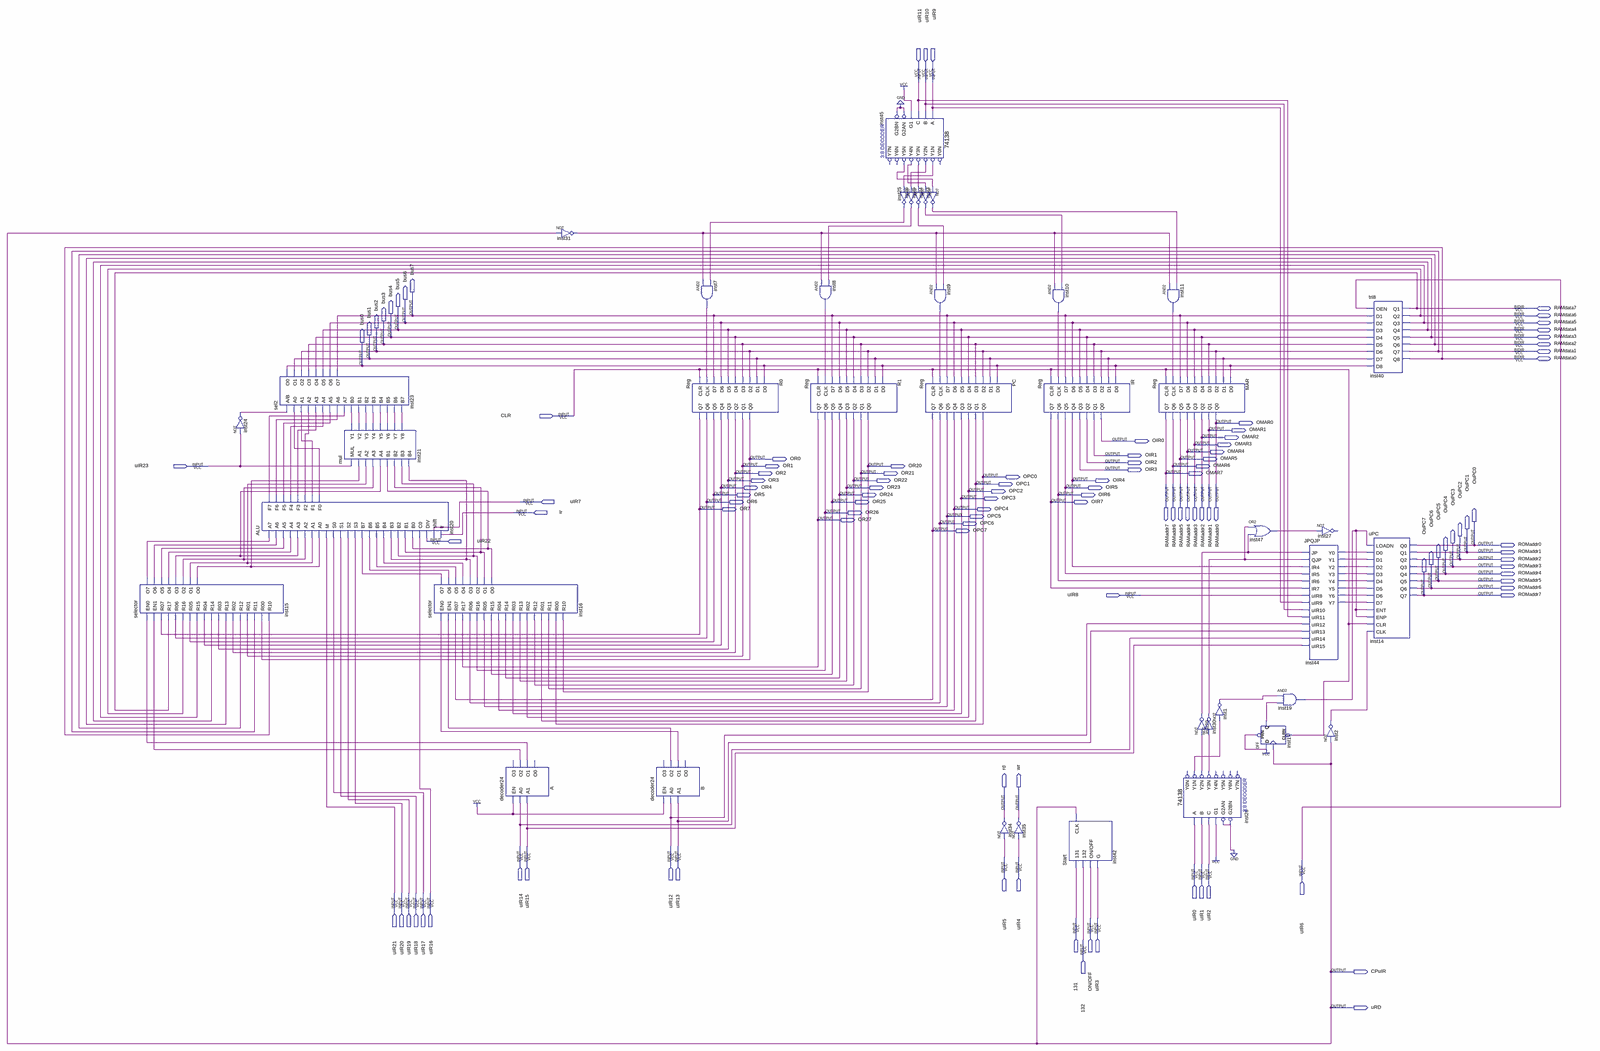
[diagram p0: schematic sheet, whole]
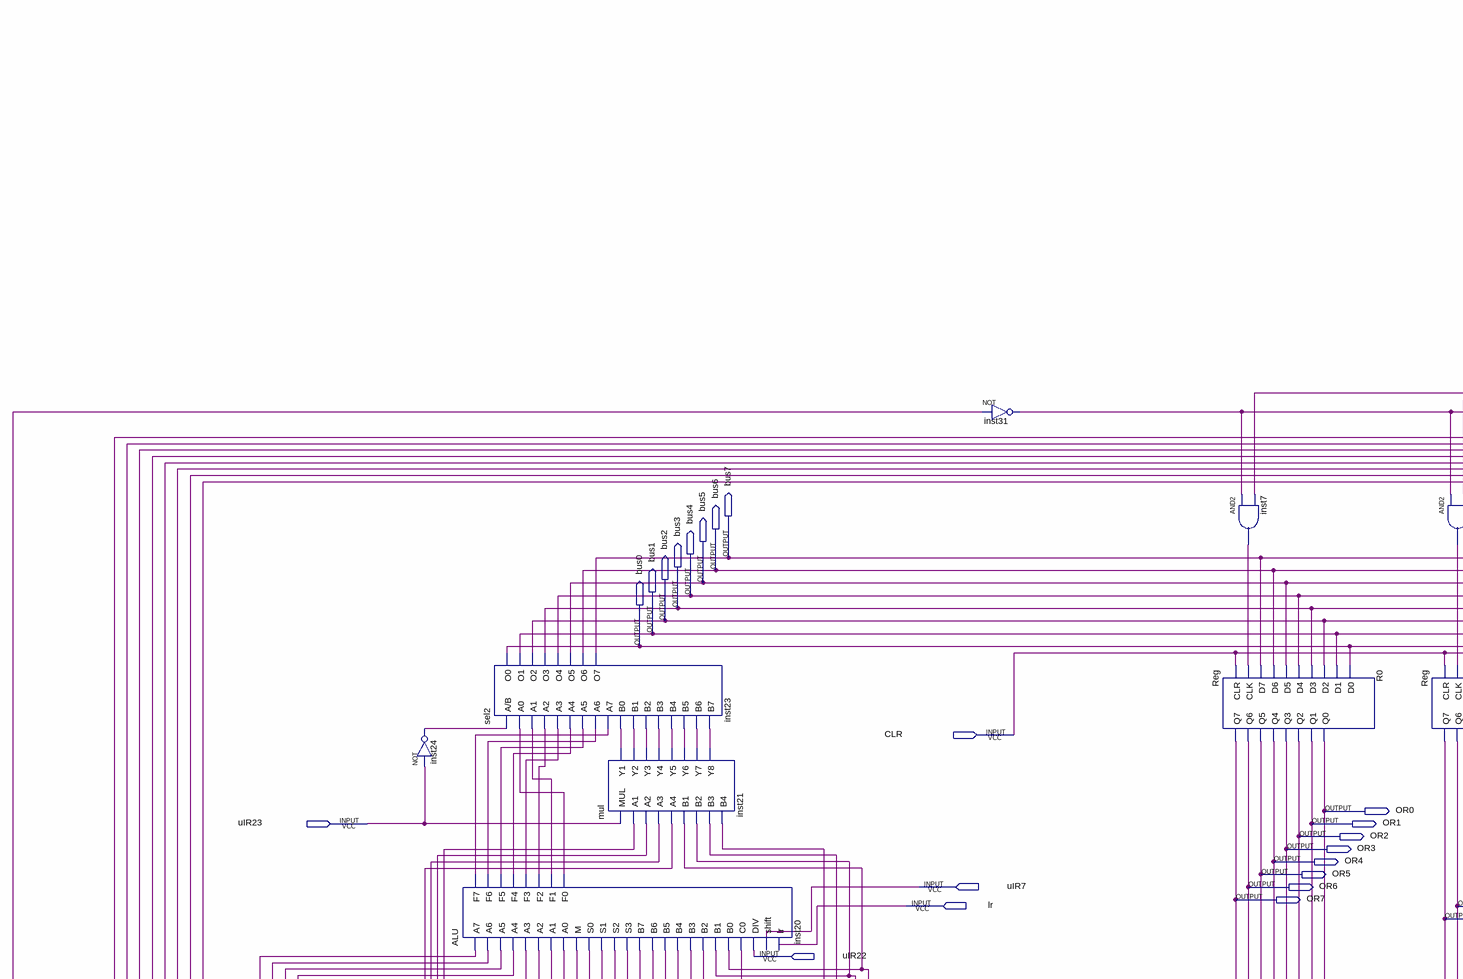
[diagram p1: schematic sheet, upper left part]
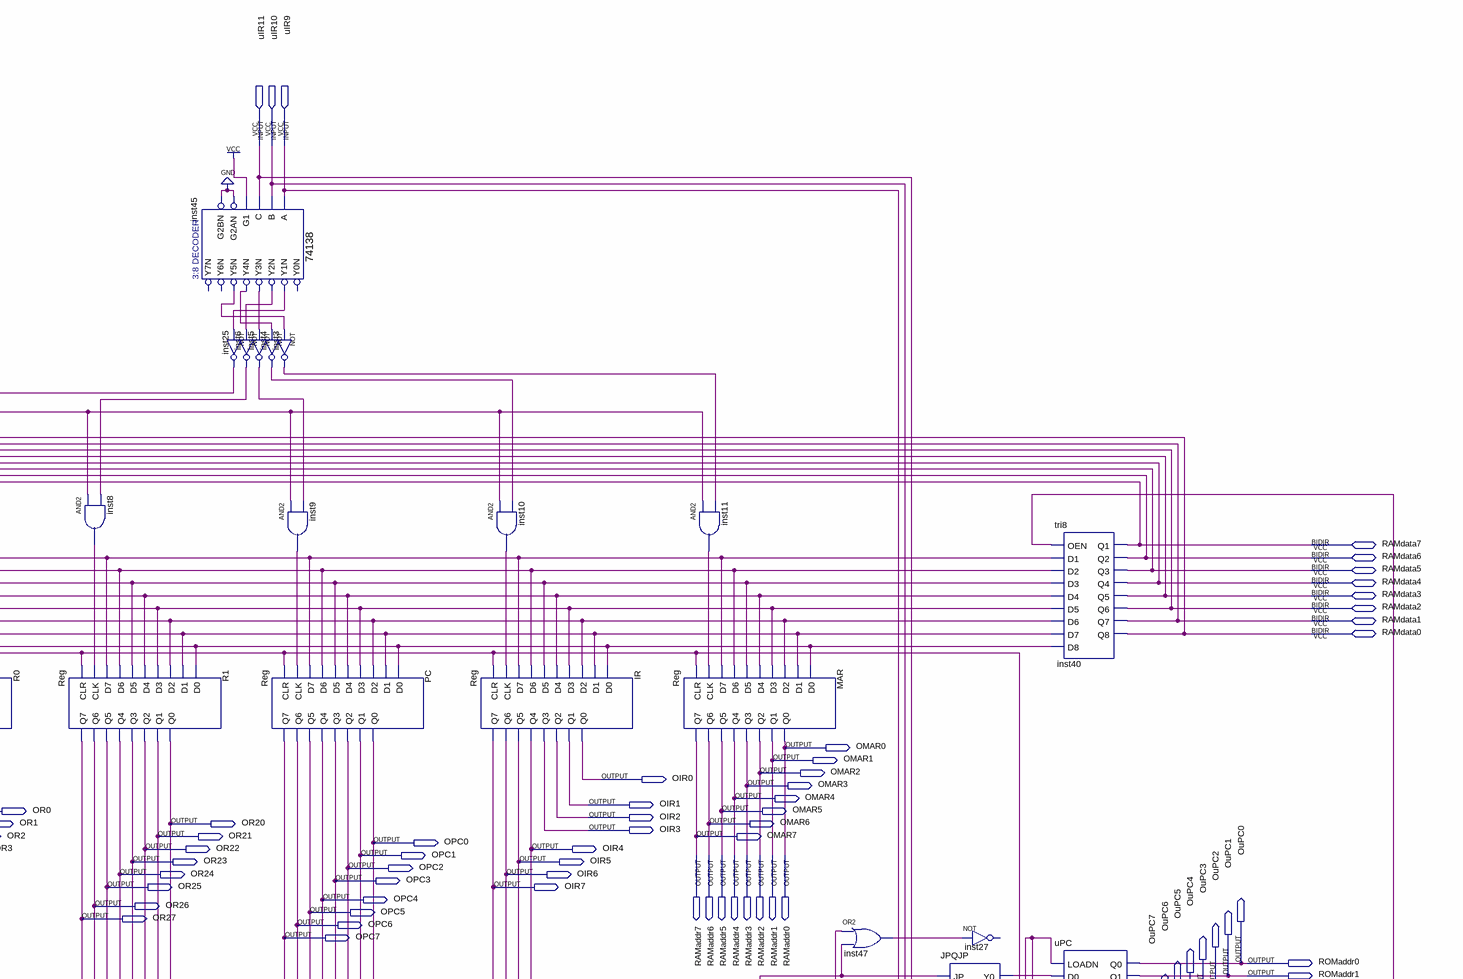
[diagram p2: schematic sheet, upper right part]
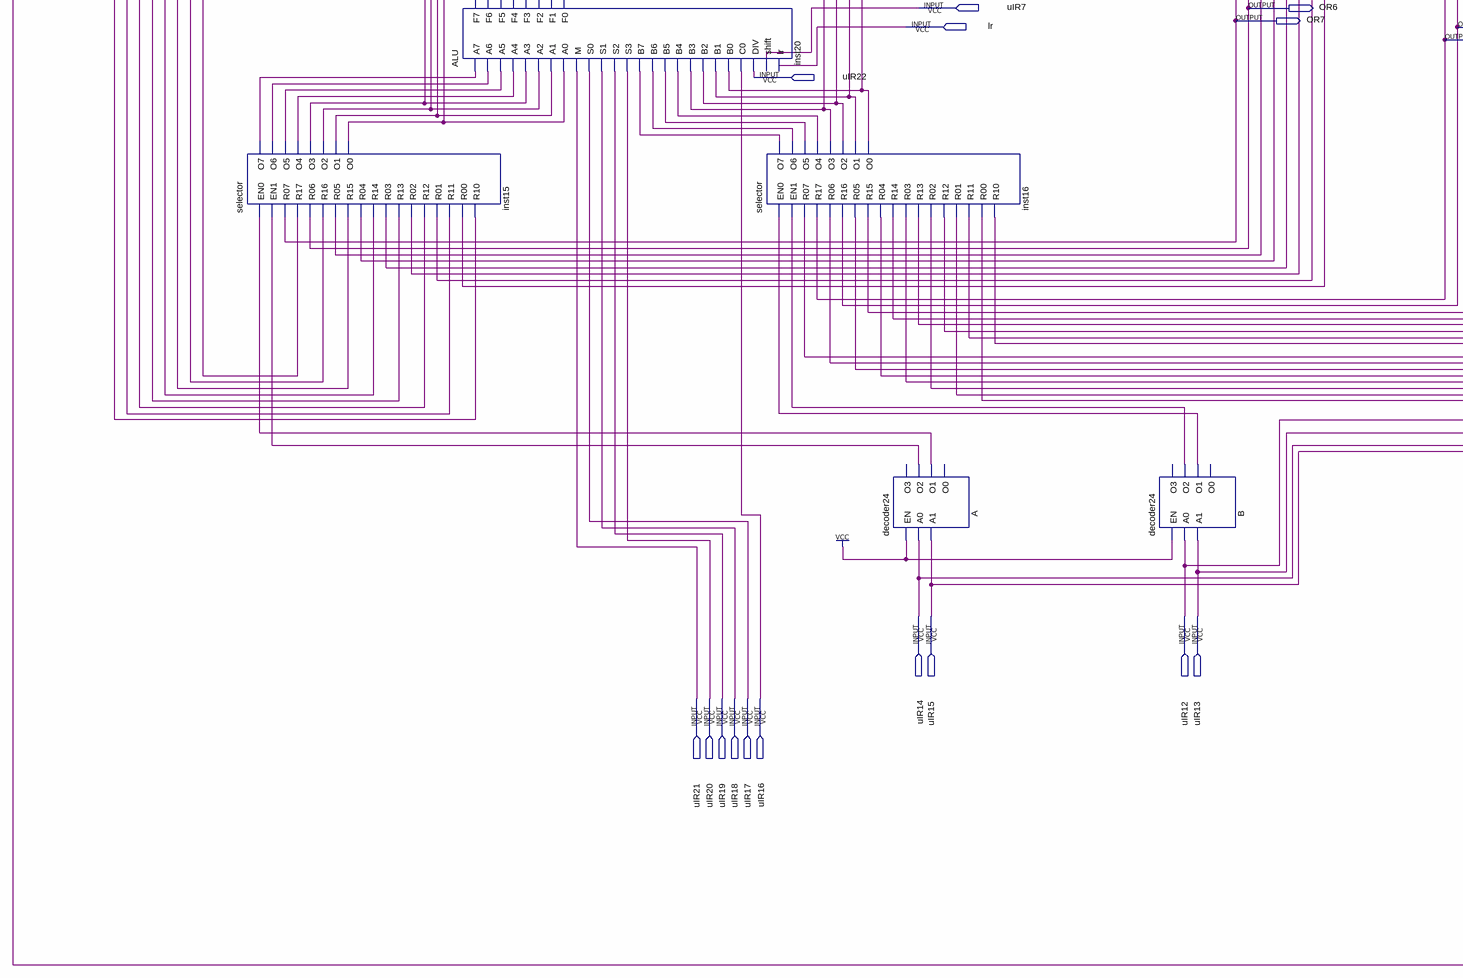
[diagram p3: schematic sheet, lower left part]
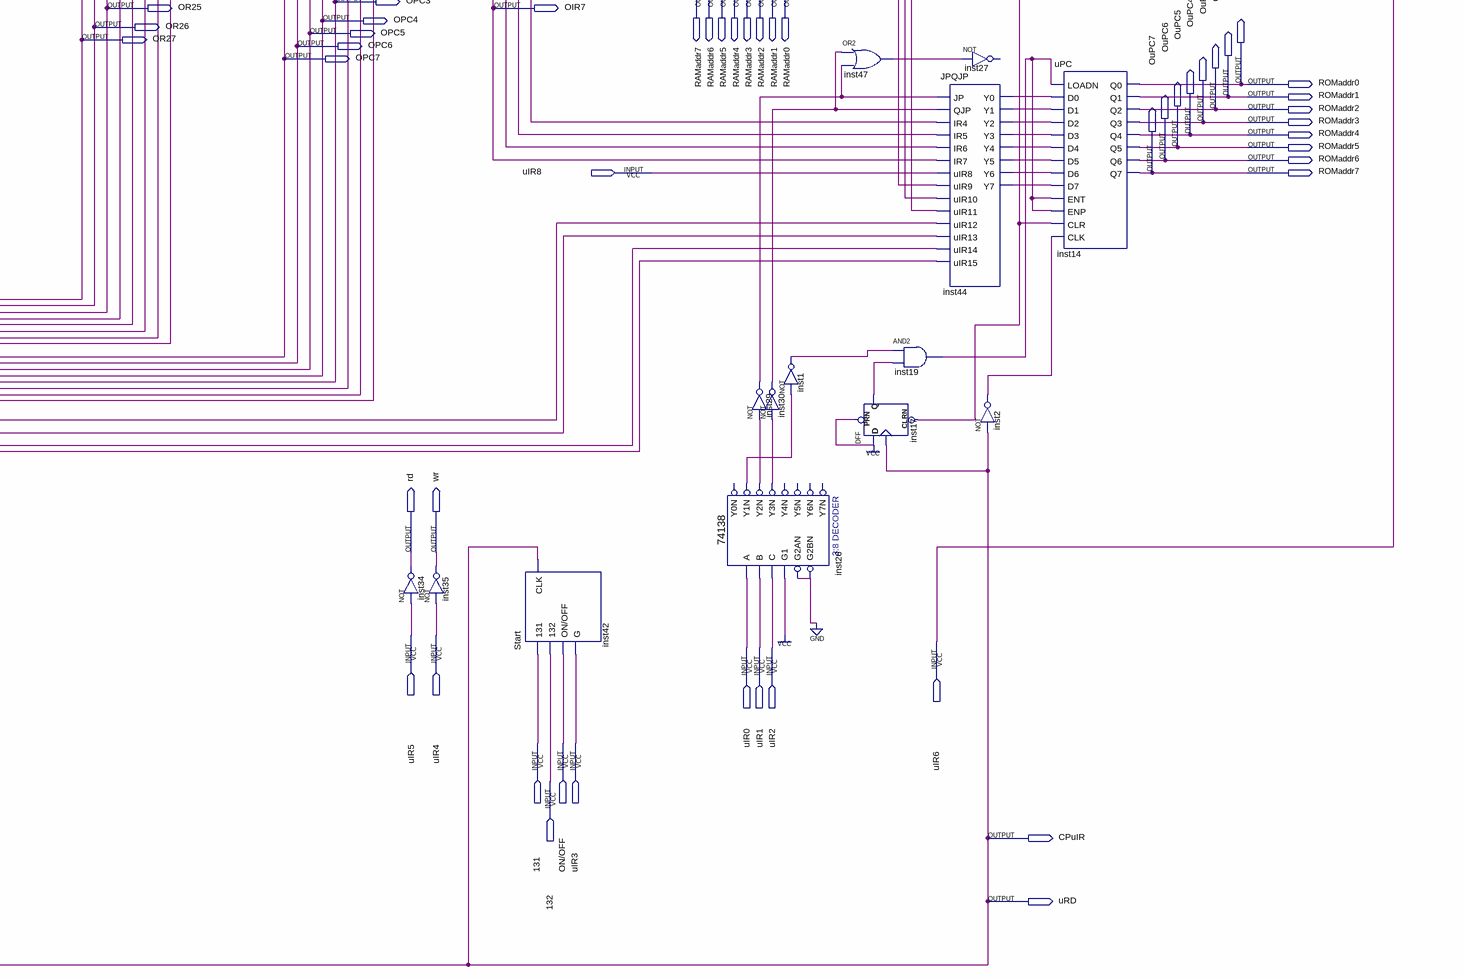
[diagram p4: schematic sheet, lower right part]
// Quartus schematic EXP3.bdf as structural Verilog: 40 symbols, 113 pins
module EXP3 (
  input  uIR11,
  input  uIR10,
  input  uIR9,
  input  CLR,
  input  uIR23,
  input  uIR7,
  input  lr,
  input  uIR22,
  input  uIR8,
  input  uIR14,
  input  uIR15,
  input  uIR12,
  input  uIR13,
  input  uIR5,
  input  uIR4,
  input  uIR6,
  input  uIR0,
  input  uIR1,
  input  uIR2,
  input  uIR21,
  input  uIR20,
  input  uIR19,
  input  uIR18,
  input  uIR17,
  input  uIR16,
  input  \131 ,
  input  \ON/OFF ,
  input  uIR3,
  input  \132 ,
  inout  RAMdata7,
  inout  RAMdata6,
  inout  RAMdata5,
  inout  RAMdata4,
  inout  RAMdata3,
  inout  RAMdata2,
  inout  RAMdata1,
  inout  RAMdata0,
  output bus7,
  output bus6,
  output bus5,
  output bus4,
  output bus3,
  output bus2,
  output bus1,
  output bus0,
  output OMAR0,
  output OMAR1,
  output OMAR2,
  output OIR0,
  output OMAR3,
  output OMAR4,
  output OIR1,
  output OR0,
  output OMAR5,
  output OIR2,
  output OR1,
  output OR20,
  output OMAR6,
  output OIR3,
  output OR2,
  output OR21,
  output OMAR7,
  output OPC0,
  output OR3,
  output OR22,
  output OIR4,
  output OPC1,
  output RAMaddr7,
  output RAMaddr6,
  output RAMaddr5,
  output RAMaddr4,
  output RAMaddr3,
  output RAMaddr2,
  output RAMaddr1,
  output RAMaddr0,
  output OR4,
  output OR23,
  output OIR5,
  output OPC2,
  output OR5,
  output OR24,
  output OIR6,
  output OPC3,
  output OR6,
  output OR25,
  output OIR7,
  output OR7,
  output OPC4,
  output OR26,
  output OPC5,
  output OR27,
  output OPC6,
  output OPC7,
  output OuPC0,
  output ROMaddr0,
  output OuPC1,
  output ROMaddr1,
  output OuPC2,
  output ROMaddr2,
  output OuPC3,
  output ROMaddr3,
  output OuPC4,
  output ROMaddr4,
  output OuPC5,
  output ROMaddr5,
  output OuPC6,
  output ROMaddr6,
  output OuPC7,
  output ROMaddr7,
  output rd,
  output wr,
  output CPuIR,
  output uRD
);

  wire A_o1, A_o2, B_o1, B_o2, inst1_out, inst2_out, inst3_out, inst4_out, inst5_out, inst6_out, inst7_out,
       inst8_out, inst9_out, inst10_out, inst11_out, inst15_o0, inst15_o1, inst15_o2, inst15_o3, inst15_o4,
       inst15_o5, inst15_o6, inst15_o7, inst16_o0, inst16_o1, inst16_o2, inst16_o3, inst16_o4, inst16_o5,
       inst16_o6, inst16_o7, inst17_q, inst19_out, inst20_f0, inst20_f1, inst20_f2, inst20_f3, inst20_f4,
       inst20_f5, inst20_f6, inst20_f7, inst21_y1, inst21_y2, inst21_y3, inst21_y4, inst21_y5, inst21_y6,
       inst21_y7, inst21_y8, inst24_out, inst25_out, inst26_y1n, inst26_y2n, inst26_y3n, inst29_out,
       inst30_out, inst31_out, inst44_y0, inst44_y1, inst44_y2, inst44_y3, inst44_y4, inst44_y5, inst44_y6,
       inst44_y7, inst45_y1n, inst45_y2n, inst45_y3n, inst45_y4n, inst45_y5n, inst47_out;

  selector inst15 (
    .EN0(A_o1), .EN1(A_o2), .R07(OR7), .R17(RAMdata7), .R06(OR6), .R16(RAMdata6), .R05(OR5), .R15(RAMdata5),
    .R04(OR4), .R14(RAMdata4), .R03(OR3), .R13(RAMdata3), .R02(OR2), .R12(RAMdata2), .R01(OR1),
    .R11(RAMdata1), .R00(OR0), .R10(RAMdata0), .O7(inst15_o7), .O6(inst15_o6), .O5(inst15_o5),
    .O4(inst15_o4), .O3(inst15_o3), .O2(inst15_o2), .O1(inst15_o1), .O0(inst15_o0));
  not inst24 (inst24_out, uIR23);
  sel2 inst23 (
    .\A/B (inst24_out), .A0(inst20_f0), .A1(inst20_f1), .A2(inst20_f2), .A3(inst20_f3), .A4(inst20_f4),
    .A5(inst20_f5), .A6(inst20_f6), .A7(inst20_f7), .B0(inst21_y1), .B1(inst21_y2), .B2(inst21_y3),
    .B3(inst21_y4), .B4(inst21_y5), .B5(inst21_y6), .B6(inst21_y7), .B7(inst21_y8), .O0(bus0), .O1(bus1),
    .O2(bus2), .O3(bus3), .O4(bus4), .O5(bus5), .O6(bus6), .O7(bus7));
  ALU inst20 (
    .A7(inst15_o7), .A6(inst15_o6), .A5(inst15_o5), .A4(inst15_o4), .A3(inst15_o3), .A2(inst15_o2),
    .A1(inst15_o1), .A0(inst15_o0), .M(uIR21), .S0(uIR17), .S1(uIR18), .S2(uIR19), .S3(uIR20),
    .B7(inst16_o7), .B6(inst16_o6), .B5(inst16_o5), .B4(inst16_o4), .B3(inst16_o3), .B2(inst16_o2),
    .B1(inst16_o1), .B0(inst16_o0), .C0(uIR16), .DIV(uIR22), .shift(uIR7), .lr(lr), .F7(inst20_f7),
    .F6(inst20_f6), .F5(inst20_f5), .F4(inst20_f4), .F3(inst20_f3), .F2(inst20_f2), .F1(inst20_f1),
    .F0(inst20_f0));
  mul inst21 (
    .MUL(uIR23), .A1(inst15_o0), .A2(inst15_o1), .A3(inst15_o2), .A4(inst15_o3), .B1(inst16_o0),
    .B2(inst16_o1), .B3(inst16_o2), .B4(inst16_o3), .Y1(inst21_y1), .Y2(inst21_y2), .Y3(inst21_y3),
    .Y4(inst21_y4), .Y5(inst21_y5), .Y6(inst21_y6), .Y7(inst21_y7), .Y8(inst21_y8));
  selector inst16 (
    .EN0(B_o1), .EN1(B_o2), .R07(OPC7), .R17(OR27), .R06(OPC6), .R16(OR26), .R05(OPC5), .R15(OR25),
    .R04(OPC4), .R14(OR24), .R03(OPC3), .R13(OR23), .R02(OPC2), .R12(OR22), .R01(OPC1), .R11(OR21),
    .R00(OPC0), .R10(OR20), .O7(inst16_o7), .O6(inst16_o6), .O5(inst16_o5), .O4(inst16_o4), .O3(inst16_o3),
    .O2(inst16_o2), .O1(inst16_o1), .O0(inst16_o0));
  decoder24 A (.EN(1'b1), .A0(uIR14), .A1(uIR15), .O2(A_o2), .O1(A_o1));  // open: O3, O0
  not inst31 (inst31_out, CPuIR);
  decoder24 B (.EN(1'b1), .A0(uIR12), .A1(uIR13), .O2(B_o2), .O1(B_o1));  // open: O3, O0
  and inst7 (inst7_out, inst31_out, inst25_out);
  Reg R0 (
    .CLR(CLR), .CLK(inst7_out), .D7(bus7), .D6(bus6), .D5(bus5), .D4(bus4), .D3(bus3), .D2(bus2), .D1(bus1),
    .D0(bus0), .Q7(OR7), .Q6(OR6), .Q5(OR5), .Q4(OR4), .Q3(OR3), .Q2(OR2), .Q1(OR1), .Q0(OR0));
  and inst8 (inst8_out, inst31_out, inst6_out);
  Reg R1 (
    .CLR(CLR), .CLK(inst8_out), .D7(bus7), .D6(bus6), .D5(bus5), .D4(bus4), .D3(bus3), .D2(bus2), .D1(bus1),
    .D0(bus0), .Q7(OR27), .Q6(OR26), .Q5(OR25), .Q4(OR24), .Q3(OR23), .Q2(OR22), .Q1(OR21), .Q0(OR20));
  \74138  inst45 (
    .A(uIR9), .B(uIR10), .G1(1'b1), .C(uIR11), .G2AN(1'b0), .G2BN(1'b0), .Y1N(inst45_y1n), .Y2N(inst45_y2n),
    .Y3N(inst45_y3n), .Y4N(inst45_y4n), .Y5N(inst45_y5n));  // open: Y0N, Y6N, Y7N
  not inst5 (inst5_out, inst45_y3n);
  not inst6 (inst6_out, inst45_y2n);
  not inst25 (inst25_out, inst45_y1n);
  not inst3 (inst3_out, inst45_y5n);
  not inst4 (inst4_out, inst45_y4n);
  and inst9 (inst9_out, inst31_out, inst5_out);
  Reg PC (
    .CLR(CLR), .CLK(inst9_out), .D7(bus7), .D6(bus6), .D5(bus5), .D4(bus4), .D3(bus3), .D2(bus2), .D1(bus1),
    .D0(bus0), .Q7(OPC7), .Q6(OPC6), .Q5(OPC5), .Q4(OPC4), .Q3(OPC3), .Q2(OPC2), .Q1(OPC1), .Q0(OPC0));
  not inst34 (rd, uIR5);
  not inst35 (wr, uIR4);
  and inst10 (inst10_out, inst31_out, inst4_out);
  Reg IR (
    .CLR(CLR), .CLK(inst10_out), .D7(bus7), .D6(bus6), .D5(bus5), .D4(bus4), .D3(bus3), .D2(bus2), .D1(bus1),
    .D0(bus0), .Q7(OIR7), .Q6(OIR6), .Q5(OIR5), .Q4(OIR4), .Q3(OIR3), .Q2(OIR2), .Q1(OIR1), .Q0(OIR0));
  Start inst42 (.\131 (\131 ), .\132 (\132 ), .\ON/OFF (\ON/OFF ), .G(uIR3), .CLK(CPuIR));
  and inst11 (inst11_out, inst31_out, inst3_out);
  Reg MAR (
    .CLR(CLR), .CLK(inst11_out), .D7(bus7), .D6(bus6), .D5(bus5), .D4(bus4), .D3(bus3), .D2(bus2), .D1(bus1),
    .D0(bus0), .Q7(OMAR7), .Q6(OMAR6), .Q5(OMAR5), .Q4(OMAR4), .Q3(OMAR3), .Q2(OMAR2), .Q1(OMAR1), .Q0(OMAR0));
  not inst29 (inst29_out, inst26_y2n);
  \74138  inst26 (
    .A(uIR0), .B(uIR1), .G1(1'b1), .C(uIR2), .G2AN(1'b0), .G2BN(1'b0), .Y1N(inst26_y1n), .Y2N(inst26_y2n),
    .Y3N(inst26_y3n));  // open: Y0N, Y4N, Y5N, Y6N, Y7N
  not inst1 (inst1_out, inst26_y1n);
  not inst30 (inst30_out, inst26_y3n);
  or inst47 (inst47_out, inst30_out, inst29_out);
  DFF inst17 (.CLRN(CLR), .CLK(CPuIR), .D(1'b1), .PRN(1'b1), .Q(inst17_q));
  and inst19 (inst19_out, inst1_out, inst17_q);
  JPQJP inst44 (
    .JP(inst29_out), .QJP(inst30_out), .IR4(OIR4), .IR5(OIR5), .IR6(OIR6), .IR7(OIR7), .uIR8(uIR8),
    .uIR9(uIR9), .uIR10(uIR10), .uIR11(uIR11), .uIR12(uIR12), .uIR13(uIR13), .uIR14(uIR14), .uIR15(uIR15),
    .Y0(inst44_y0), .Y1(inst44_y1), .Y2(inst44_y2), .Y3(inst44_y3), .Y4(inst44_y4), .Y5(inst44_y5),
    .Y6(inst44_y6), .Y7(inst44_y7));
  // NOT inst27 has open pins: IN=inst47_out, OUT=open
  not inst2 (inst2_out, CPuIR);
  tri8 inst40 (
    .OEN(uIR6), .D1(bus7), .D2(bus6), .D3(bus5), .D4(bus4), .D5(bus3), .D6(bus2), .D7(bus1), .D8(bus0),
    .Q1(RAMdata7), .Q2(RAMdata6), .Q3(RAMdata5), .Q4(RAMdata4), .Q5(RAMdata3), .Q6(RAMdata2), .Q7(RAMdata1),
    .Q8(RAMdata0));
  uPC inst14 (
    .LOADN(inst19_out), .D0(inst44_y0), .D1(inst44_y1), .D2(inst44_y2), .D3(inst44_y3), .D4(inst44_y4),
    .D5(inst44_y5), .D6(inst44_y6), .D7(inst44_y7), .ENT(inst19_out), .ENP(inst19_out), .CLR(CLR),
    .CLK(inst2_out), .Q0(OuPC0), .Q1(OuPC1), .Q2(OuPC2), .Q3(OuPC3), .Q4(OuPC4), .Q5(OuPC5), .Q6(OuPC6),
    .Q7(OuPC7));

  assign RAMaddr0 = OMAR0;
  assign RAMaddr1 = OMAR1;
  assign RAMaddr2 = OMAR2;
  assign RAMaddr3 = OMAR3;
  assign RAMaddr4 = OMAR4;
  assign RAMaddr5 = OMAR5;
  assign RAMaddr6 = OMAR6;
  assign RAMaddr7 = OMAR7;
  assign ROMaddr0 = OuPC0;
  assign ROMaddr1 = OuPC1;
  assign ROMaddr2 = OuPC2;
  assign ROMaddr3 = OuPC3;
  assign ROMaddr4 = OuPC4;
  assign ROMaddr5 = OuPC5;
  assign ROMaddr6 = OuPC6;
  assign ROMaddr7 = OuPC7;
  assign uRD = CPuIR;
endmodule
